# EAGLE design flasher_without_opto (EAGLE 7.7.0)
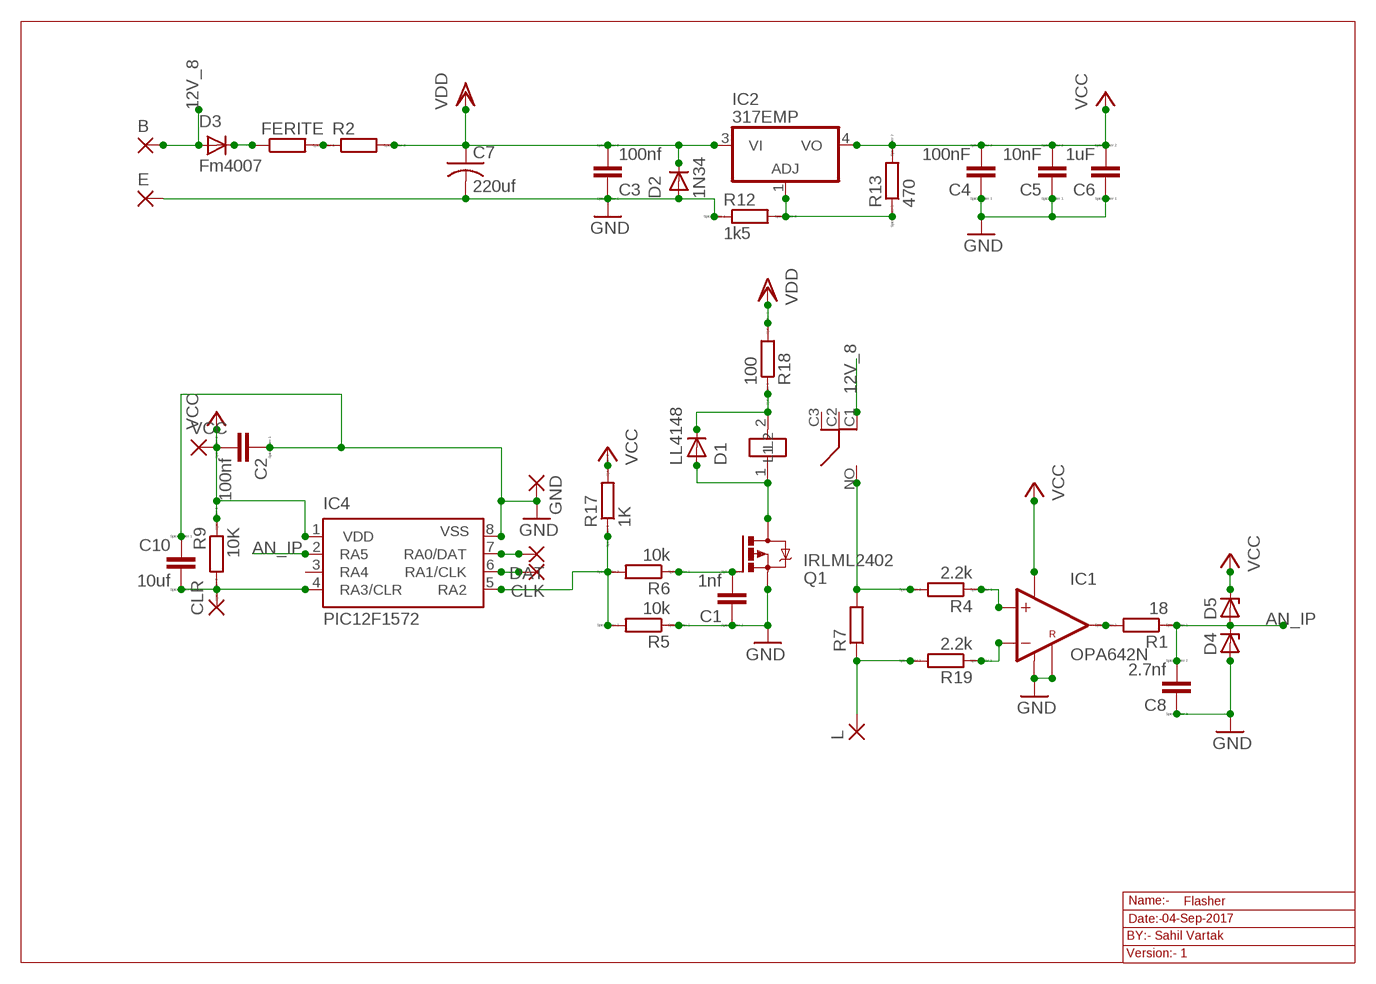
[diagram p0: schematic, sheet 1]

## Parts
B  2,54/1,1  [2,54/1,1]
C1  1nf  CC0603  [C0603]
C2  100nf  CC0603  [C0603]
C3  100nf  CC0603  [C0603]
C4  100nF  CC0603  [C0603]
C5  10nF  CC0603  [C0603]
C6  1uF  CC0603  [C0603]
C7  220uf  C-US025-025X050  [C025-025X050]
C8  2.7nf  CC0603  [C0603]
C10  10uf  CC0603  [C0603]
CLK  1,6/0,8  [1,6/0,8]
CLR  1,6/0,8  [1,6/0,8]
D1  LL4148  GF1  [SMA-DO214AC]
D2  1N34  GF1  [SMA-DO214AC]
D3  Fm4007  GF1  [SMA-DO214AC]
D4  ZENER-DIODESOD80C  [SOD80C]
D5  ZENER-DIODESOD80C  [SOD80C]
DAT  1,6/0,8  [1,6/0,8]
E  2,54/1,1  [2,54/1,1]
FERITE  R-EU_R0603  [R0603]
GND  1,6/0,8  [1,6/0,8]
IC1  OPA642N  [INA181]
IC2  317EMP  [SOT223]
IC4  PIC12F1572  PIC12F675SN  [SO-08]
K2  RL703  [RL703]
L  2,54/1,1  [2,54/1,1]
Q1  IRLML2402  IRLML5203  [MICRO3]
R1  18  RR0603  [R0603]
R2  RR5025  [R5025]
R4  2.2k  RR0603  [R0603]
R5  10k  RR0603  [R0603]
R6  10k  RR0603  [R0603]
R7  R-EU_0207/15  [0207/15]
R9  10K  RR0603  [R0603]
R12  1k5  RR0603  [R0603]
R13  470  RR0603  [R0603]
R17  1K  RR0603  [R0603]
R18  100  RR0603  [R0603]
R19  2.2k  RR0603  [R0603]
VCC  1,6/0,8  [1,6/0,8]

## Nets
12V_8: B.1(P) D3.A K2.C1
AN_IP: C8.2 D4.C D5.A IC4.2(RA5) R1.1
GND: C1.1 C2.1 C3.1 C4.1 C5.1 C6.1 C7.2 C8.1 C10.1 D2.A D4.A E.1(P) GND.1(P) IC1.P$2(V-) IC1.P$5(REF) IC4.8(VSS) Q1.2(S) R5.1 R12.1
N$1: FERITE.2 R2.1
N$3: IC4.5(RA2) R5.2 R6.2 R17.1
N$5: D1.A K2.1(L2) Q1.3(D)
N$7: D3.K(C) FERITE.1
N$8: DAT.1(P) IC4.7(RA0/DAT)
N$9: CLK.1(P) IC4.6(RA1/CLK)
N$13: D1.K(C) K2.2(L1) R18.1
N$14: IC2.1(ADJ) R12.2 R13.1
N$16: K2.NO R4.2 R7.2
N$19: L.1(P) R7.1 R19.2
N$21: IC1.P$4(-IN) R19.1
N$22: IC1.P$3(+IN) R4.1
N$23: IC1.P$1(OUT) R1.2
N$72: C1.2 Q1.1(G) R6.1
N$87: C10.2 CLR.1(P) IC4.4(RA3/CLR) R9.2
VCC: C2.2 C4.2 C5.2 C6.2 D5.C IC1.P$6(V+) IC2.4(VO) IC4.1(VDD) R9.1 R13.2 R17.2 VCC.1(P)
VDD: C3.2 C7.1 D2.K(C) IC2.3(VI) R2.2 R18.2
Unconnected: IC4.3(RA4) K2.C2 K2.C3

## Notes on the sheet
- Name:- | Flasher
- Date:- | 04-Sep-2017
- BY:- Sahil Vartak
- Version:- 1

## Library data of the parts
B E L = wirepad:2,54/1,1: THROUGH-HOLE PAD
C1-C6 C8 C10 = eagle-ltspice:C: CAPACITOR, European symbol; SPICEMODEL: NONE; SPICEPREFIX: C
C7 = rcl:C-US: CAPACITOR, American symbol
CLK CLR DAT GND VCC = wirepad:1,6/0,8: THROUGH-HOLE PAD
D1-D3 = diode:GF1: DIODE
D4 D5 = diode:ZENER-DIODE: Z-Diode
FERITE R7 = resistor:R-EU_: RESISTOR, European symbol
IC1 = burr-brown:OPA642N: Operational Amplifier Wideband, Low Distortion
IC2 = lm317:*317: Positive VOLTAGE REGULATOR
IC4 = microchip:PIC12F6*: Data Sheet 8-Pin FLASH-Based 8-Bit CMOS Microcontrollers Source: http://www.microchip.com .. 41190c.pdf; MF: MICROCHIP; MPN: PIC12F675-E/SN; OC_FARNELL: 9759026; OC_NEWARK: 92C4341
K2 = relay:RL703
Q1 = transistor-power:IRLML5203: HEXFET P-Channel Power MOSFET
R1 R2 R4-R6 R9 R12 R13 R17-R19 = eagle-ltspice:R: RESISTOR, European symbol; SPICEMODEL: NONE; SPICEPREFIX: R

## Board
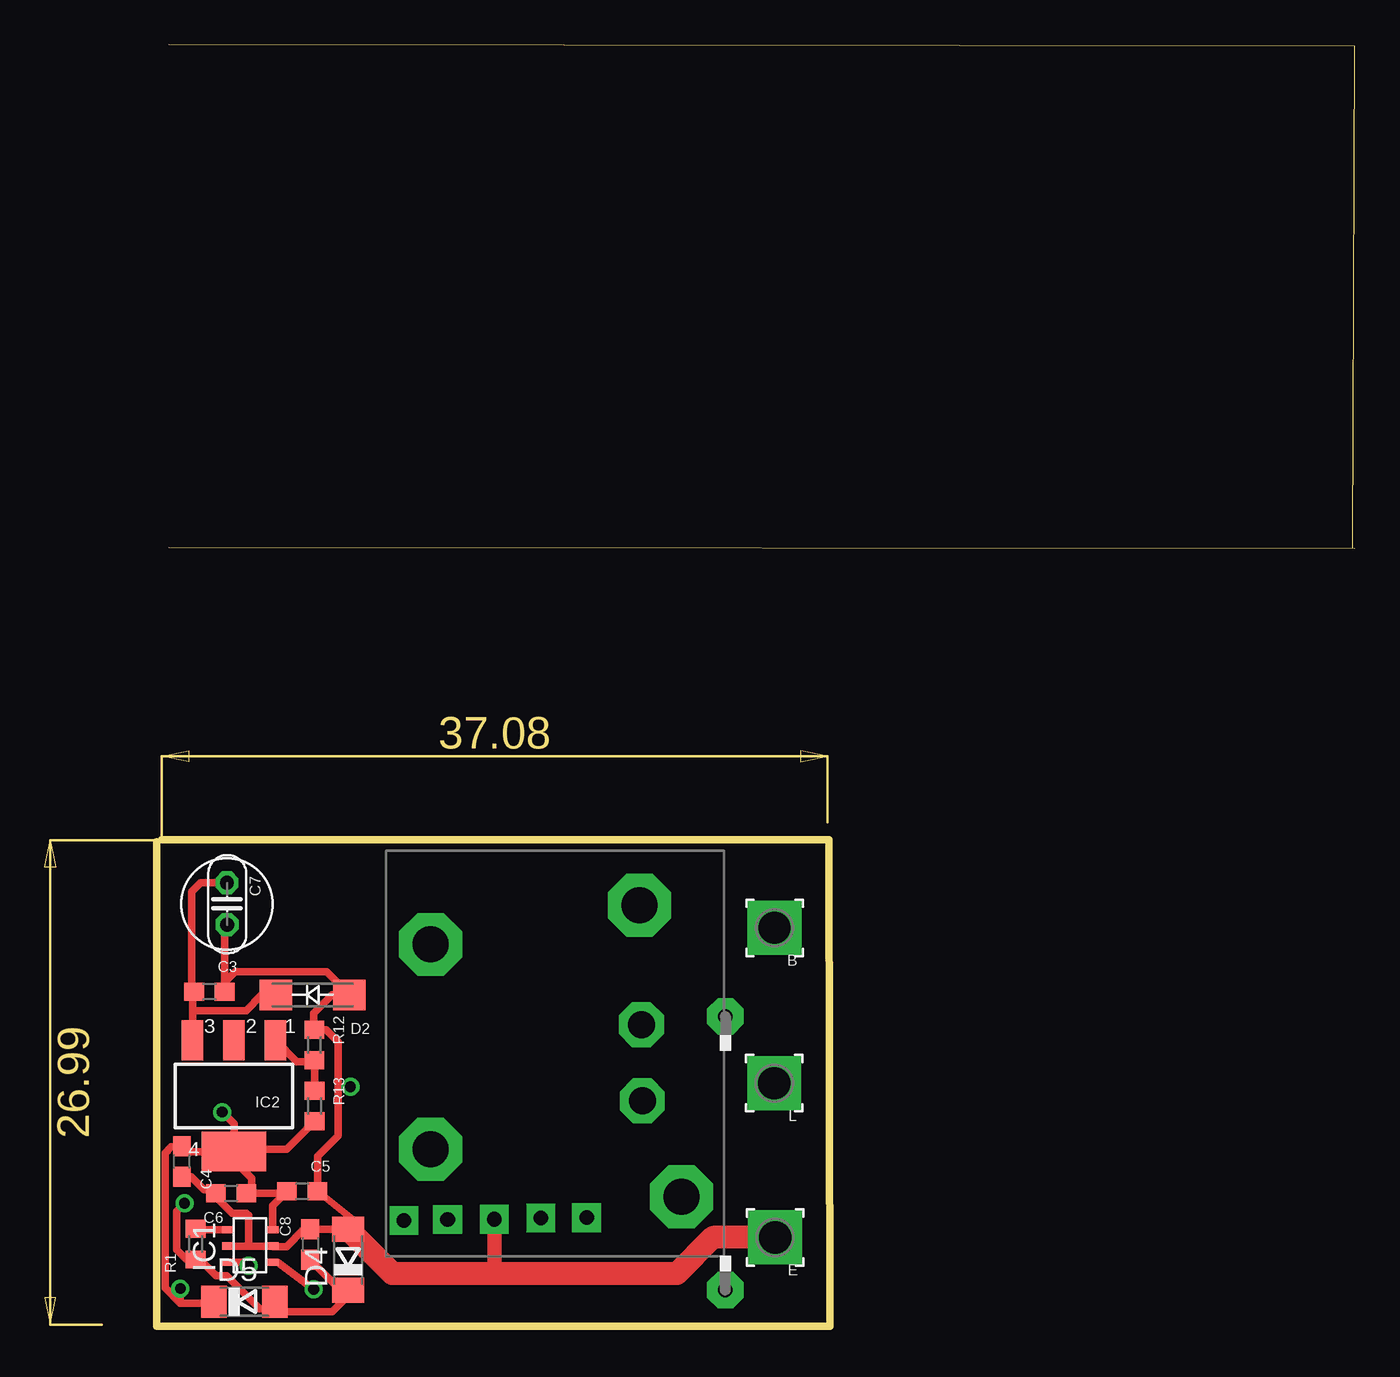
[diagram p1: board, top side]
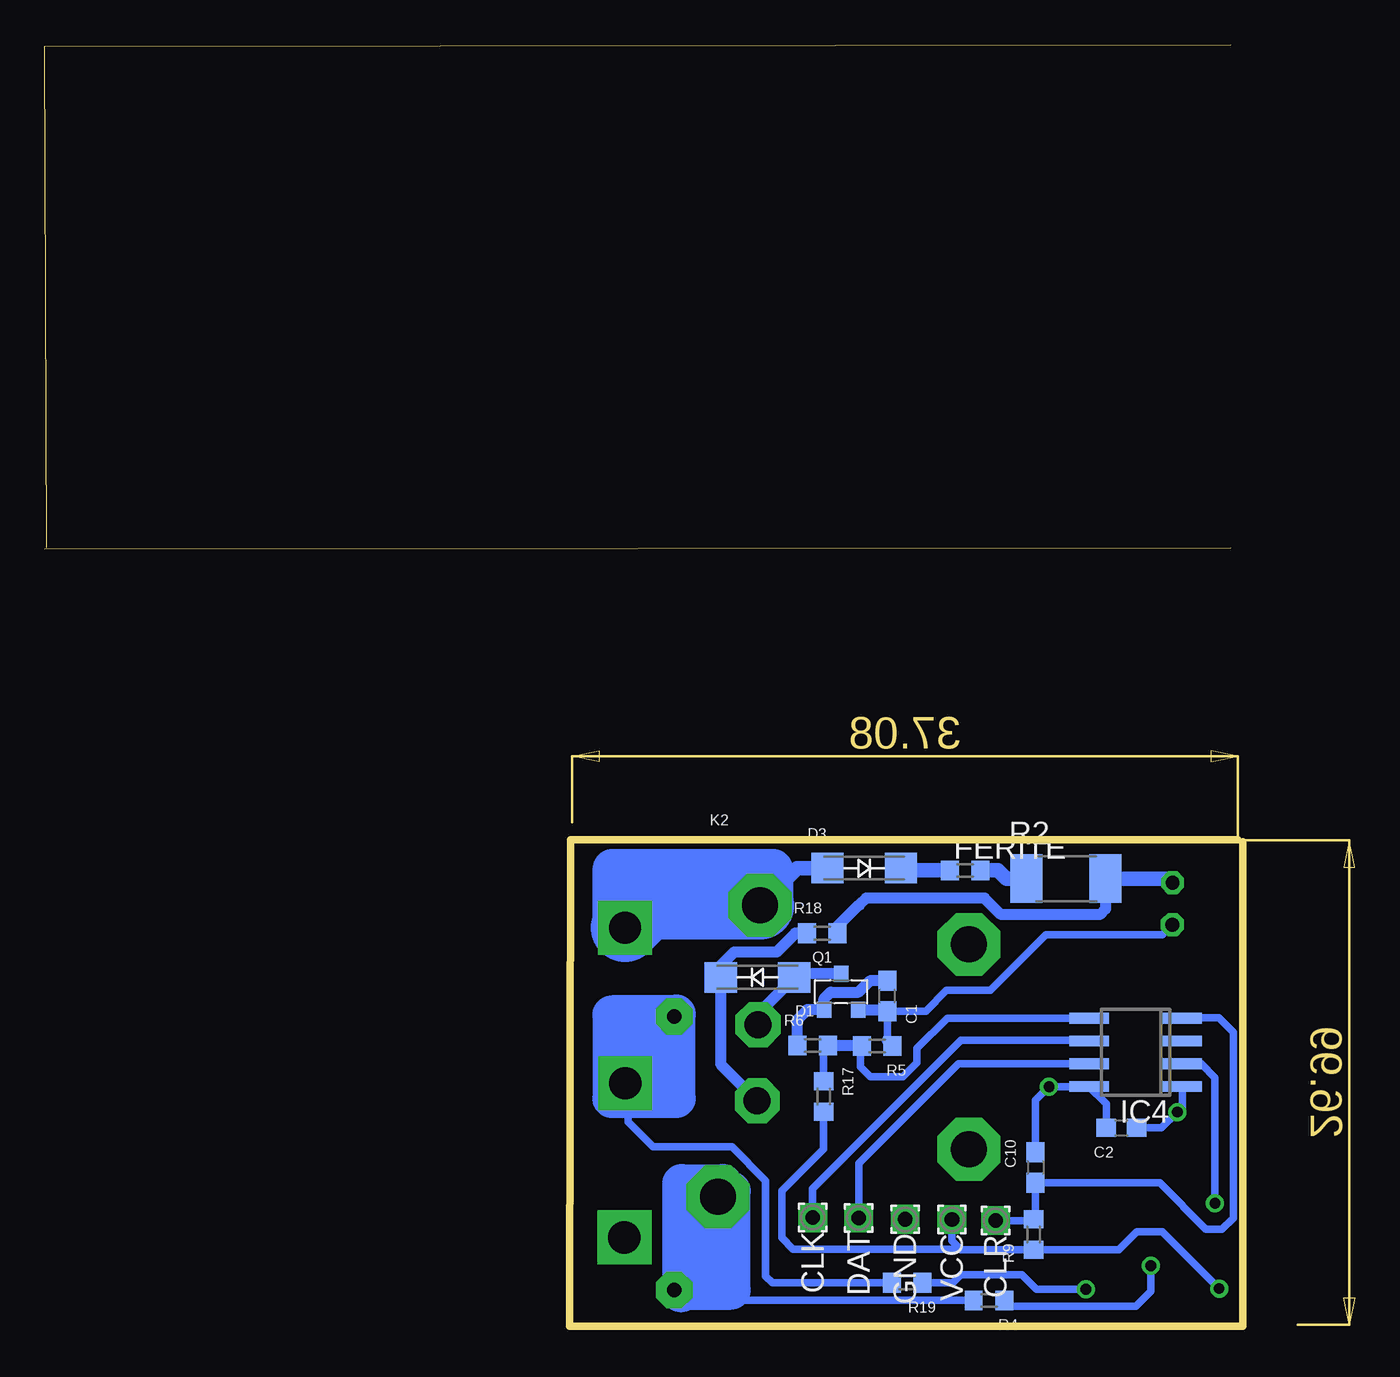
[diagram p2: board, bottom side, seen from below]

Size 66.77 x 71.39 mm. Coordinates in mm from the lower left corner, seen from the top.
Outline: 0.67,71.39 66.77,71.33 66.67,43.38
Outline: 66.77,43.32 0.67,43.38
Outline: 0.3,27.11 37.46,27.11 37.53,0 0.02,0 0,27.01
Copper layers (1*16): Top 0.035mm / dielectric 1.5mm / Bottom 0.035mm
Design rules "default": minimum track width 10mil, minimum drill 24mil, track to track 8mil, track to pad 8mil, pad to pad 8mil, via to via 8mil, smd to smd 8mil, copper to edge 40mil, drill to drill 8mil, minimum pad ring 10mil, minimum via ring 8mil, stop-mask expansion 4mil, vias tented up to drill 0mil, thermal gap 10mil

### Footprints (pad centres in the part's own frame; a part is rotated, then mirrored left to right if it is on the bottom)
2,54/1,1 = drill 1.8 pad 3 square: 1 0,0
C0603 = smd 1.1 x 1: 1 -0.85,0; 2 0.85,0
C025-025X050 = drill 0.762 pad 1.27 octagon: 1 -1.176,-0.006; 2 1.159,0.007
1,6/0,8 = drill 0.813 pad 1.6 square: 1 0,0
SMA-DO214AC = smd 1.8 x 1.7: A -2.05,0; K 2.05,0
SOD80C = smd 1.4 x 1.8: A 1.7,0; C -1.7,0
R0603 = smd 1 x 1.1: 1 -0.85,0; 2 0.85,0
INA181 = smd 0.4 x 0.7: P$1 -0.86,-1.23; P$2 0.04,-1.23; P$3 0.94,-1.23; P$4 0.94,1.24; P$5 0.04,1.24; P$6 -0.86,1.24
SOT223 = smd 1.219 x 2.235: 1 -2.311,-3.099; 2 0,-3.099; 3 2.311,-3.099 | smd 3.6 x 2.2: 4 0,3.099
SO-08 = smd 0.6 x 2.2: 1 -1.905,-2.6; 2 -0.635,-2.6; 3 0.635,-2.6; 4 1.905,-2.6; 5 1.905,2.6; 6 0.635,2.6; 7 -0.635,2.6; 8 -1.905,2.6
RL703 = drill 1.5 pad 2.5 octagon: 1 1.73,-5.643; 2 -2.51,-5.693 | drill 2 pad 3.5 octagon: C1 8.38,-5.543; C2 6.2,6.107; C3 -5.21,6.107; NO -7.86,-7.883
MICRO3 = smd 0.8 x 0.9: 1 -0.95,-1; 2 0.95,-1; 3 0,1
R5025 = smd 1.8 x 2.7: 1 -2.2,0; 2 2.2,0
0207/15 = drill 0.813 pad 2.032 octagon: 1 -7.62,0; 2 7.62,0

### Placement (x,y rotation side)
B  34.44,22.21 180 top
C1  19.83,18.41 90 bottom
C2  6.77,11.06 0 bottom
C3  2.95,18.66 180 top
C4  1.42,9.19 90 top
C5  8.12,7.53 180 top
C6  4.17,7.42 0 top
C7  3.93,23.54 270 top
C8  8.57,4.56 270 top
C10  11.57,8.85 270 bottom
CLK  23.97,6.06 180 bottom
CLR  13.79,5.9 180 bottom
D1  27.06,19.45 180 bottom
D2  8.71,18.47 180 top
D3  21.11,25.53 0 bottom
D4  10.68,3.71 90 top
D5  4.9,1.38 0 top
DAT  21.41,6.04 180 bottom
E  34.47,4.96 180 top
FERITE  15.49,25.4 0 bottom
GND  18.83,5.97 180 bottom
IC1  5.23,4.52 270 top
IC2  4.32,12.84 180 top
IC4  5.99,15.27 90 bottom
K2  21.38,15.08 90 top
L  34.43,13.55 180 top
Q1  22.4,18.64 0 bottom
R1  2.18,4.58 90 top
R2  9.87,24.94 0 bottom
R4  14.16,1.45 180 bottom
R5  20.39,15.63 180 bottom
R6  23.98,15.65 0 bottom
R7  31.7,9.65 270 top
R9  11.67,5.13 90 bottom
R12  8.8,15.68 270 top
R13  8.81,12.29 270 top
R17  23.37,12.81 270 bottom
R18  23.44,21.91 0 bottom
R19  18.71,2.43 180 bottom
VCC  16.22,5.96 180 bottom

### Tracks (layer width: path | path; a pad name or v marks a point on that pad's centre or on a via)
12V_8
  Bottom 0.813: D3.A 24.85,25.53 K2.C1
  Bottom 3.81: K2.C1 33.19,23.46 B.1
AN_IP  (via drill 0.6)
  Top 0.406: C8.2 10.27,2.01 D4.C 10.68,1.71 9.8,0.83 7.15,0.83 D5.A 6.27,0.83 6.12,0.98 5.75,0.98 4.95,1.78 4.95,1.79 3.92,2.82 3.32,2.82 2.41,3.73 R1.1 1.66,3.73 1.13,4.26 1.13,6.43 v1.56,6.86
  Bottom 0.406: IC4.2 2.33,14.63 1.56,13.86 v1.56,6.86
GND  (via drill 0.6)
  Top 0.406: 5.27,4.48 IC1.P$5 6.5,4.45 7.24,4.45 8.2,5.41 C8.1 D4.A 11.1,5.83 C5.1 8.97,9.47 10.12,10.62 10.12,13.32 | 5.27,4.48 IC1.P$2 | 3.13,7.61 C6.1 | C6.1 3.32,7.2 4.21,6.31 5.01,6.31 5.13,6.19 5.13,4.62 5.27,4.48 | 10.12,13.32 10.12,15.87 9.45,16.54 8.81,16.54 R12.1 8.77,16.55 8.77,17.46 9.78,18.47 D2.A 9.47,19.75 4.39,19.75 3.8,19.16 | v10.81,13.35 10.15,13.35 10.12,13.32 | C4.1 1.92,8.34 2.65,7.61 3.12,7.61 C6.1 | 18.83,3.15 19.04,2.94 | C3.1 3.8,19.16 | 3.8,19.16 3.8,22.24 C7.2
  Top 0.61: 19.51,3.17 19.74,2.94
  Top 0.813: GND.1 18.83,3.15
  Top 1.27: E.1 31.02,4.96 29,2.94 19.74,2.94 19.04,2.94 13.15,2.94 D4.A
  Bottom 0.406: C2.1 7.62,12.4 IC4.8 10.79,13.36 v10.81,13.35 11.57,12.59 C10.1 | 19.82,15.92 C1.1 17.68,17.56 16.52,18.72 14.09,18.72 10.98,21.83 4.49,21.83 C7.2
  Bottom 0.61: Q1.2 19.91,17.64 C1.1 | 19.82,15.92 R5.1
N$1
  Bottom 0.813: R2.1 13.19,24.94 13.65,25.4 FERITE.2
N$3
  Bottom 0.406: IC4.5 16.48,17.17 18.17,15.49 18.17,14.68 18.95,13.9 20.76,13.9 21.32,14.46 21.32,15.54 R5.2 | R17.1 23.37,15.42 R6.2
  Bottom 0.61: R5.2 23.11,15.63 R6.2
N$5
  Bottom 0.61: K2.1 27.02,17.43 D1.A 24.81,19.64 Q1.3
N$7
  Bottom 0.813: 18.9,25.4 D3.K 18.93,25.4 FERITE.1
N$8
  Bottom 0.406: IC4.7 15.85,14.63 21.4,9.09 DAT.1
N$9
  Bottom 0.406: IC4.6 8.62,15.93 15.72,15.93 23.98,7.67 CLK.1
N$13
  Bottom 0.61: R18.1 24.94,21.91 25.77,21.08 25.77,21.07 25.99,20.85 28.36,20.85 29.14,20.07 29.14,19.48 D1.K 29.11,14.61 K2.2
N$14
  Top 0.406: IC2.1 7.81,14.76 8.81,14.76 R12.2 8.81,14.82 R13.1
N$15
  Bottom 2.184: 31.59,17.38 35.17,17.35 35.17,12.7 31.59,12.7 31.59,17.38 | 31.59,17.38 31.59,17.4
N$16
  Bottom 0.406: R4.2 30.74,1.45 R7.2
  Bottom 1.016: K2.NO 29.26,4.01 R7.2
N$18
  Bottom 2.184: 31.18,2.03 28.53,2.03 28.53,7.55
N$19
  Bottom 0.406: R7.1 33.33,17.23 34.46,16.1 34.46,13.59 L.1 34.28,13.41 34.28,11.41 32.87,10 28.47,10 26.6,8.13 26.6,2.8 26.23,2.43 R19.2
N$20
  Bottom 2.184: 31.36,1.88 31.27,1.88 31.27,7.96 29,7.96 29,7.28
N$21  (via drill 0.6)
  Top 0.406: IC1.P$4 6.75,3.58 v8.76,2.07
  Bottom 0.406: v8.76,2.07 11.52,2.07 12.33,2.88 15.73,2.88 16.18,2.43 R19.1
N$22  (via drill 0.6)
  Top 0.406: IC1.P$3 4.94,3.58 v5.14,3.38
  Bottom 0.406: v5.14,3.38 5.14,1.96 5.98,1.12 12.98,1.12 R4.1
N$23
  Top 0.406: IC1.P$1 2.23,5.38 R1.2
N$24
  Bottom 2.184: 29.71,7.64 29.91,7.64 29.91,4.18
N$27
  Bottom 2.184: 33.07,16.52 33.29,16.52 33.29,13.99
N$28
  Bottom 2.184: 34.87,22 35.16,22 35.16,25.52 26.17,25.52 26.17,23.21
N$72
  Bottom 0.61: C1.2 19.85,19.28 20.76,19.28 21.42,18.62 22.99,18.62 23.35,18.26 Q1.1 24.27,17.64 24.85,17.07 24.85,15.67 R6.1
N$87
  Bottom 0.406: CLR.1 11.75,5.9 R9.2 11.57,6.08 C10.2 4.64,8 2.06,5.42 1.17,5.42 0.55,6.04 0.55,16.4 1.35,17.2 3.36,17.2 IC4.4
VCC  (via drill 0.6)
  Top 0.406: IC2.4 4.45,9.87 7.24,9.87 R13.2 | 1.77,9.74 C4.2 | IC2.4 4.32,9.24 5.3,8.26 5.3,7.7 C6.2 7.16,7.42 C5.2 6.47,6.73 IC1.P$6 | IC2.4 4.32,11.28 v3.66,11.94 | C4.2 1.38,10 0.82,10 0.48,9.66 0.48,2.15 1.33,1.3 | IC2.4 1.72,9.74 C4.2 | D5.C 3.1,1.28 1.35,1.28 1.33,1.3 | v1.33,2.11 1.33,1.3
  Bottom 0.406: IC4.1 3.39,12.21 v3.66,11.94 4.54,11.06 C2.2 | VCC.1 16.22,4.78 15.74,4.3 | R17.2 23.37,9.88 25.7,7.55 25.7,4.93 25.07,4.3 15.74,4.3 | 15.74,4.3 15.72,4.28 R9.1 6.92,4.28 5.93,5.27 4.49,5.27 v1.33,2.11
VDD
  Top 0.406: IC2.3 2,17.49 | 2,17.49 2,18.56 C3.2 1.97,18.78 1.97,24.21 2.48,24.72 C7.1 | D2.K 5.87,18.47 4.99,17.59 2.1,17.59 2,17.49
  Bottom 0.61: R2.2 7.67,23.26 7.99,22.94 13.49,22.94 14.41,23.86 20.99,23.86 21.37,23.48 21.39,23.48 22.59,22.28 R18.2
  Bottom 0.813: R2.2 4.15,24.94 C7.1